# EasyEDA Pro project 荧光充能.eprj

# Schematic Schematic1
Board Name: Board1; Create Date: 2025-11-20; Page Name: P1; Project Name: 荧光充能; Schematic Name: Schematic1; Update Date: 2025-11-20; Company: 嘉立创EDA; Page Size: A4; Version: V1.0
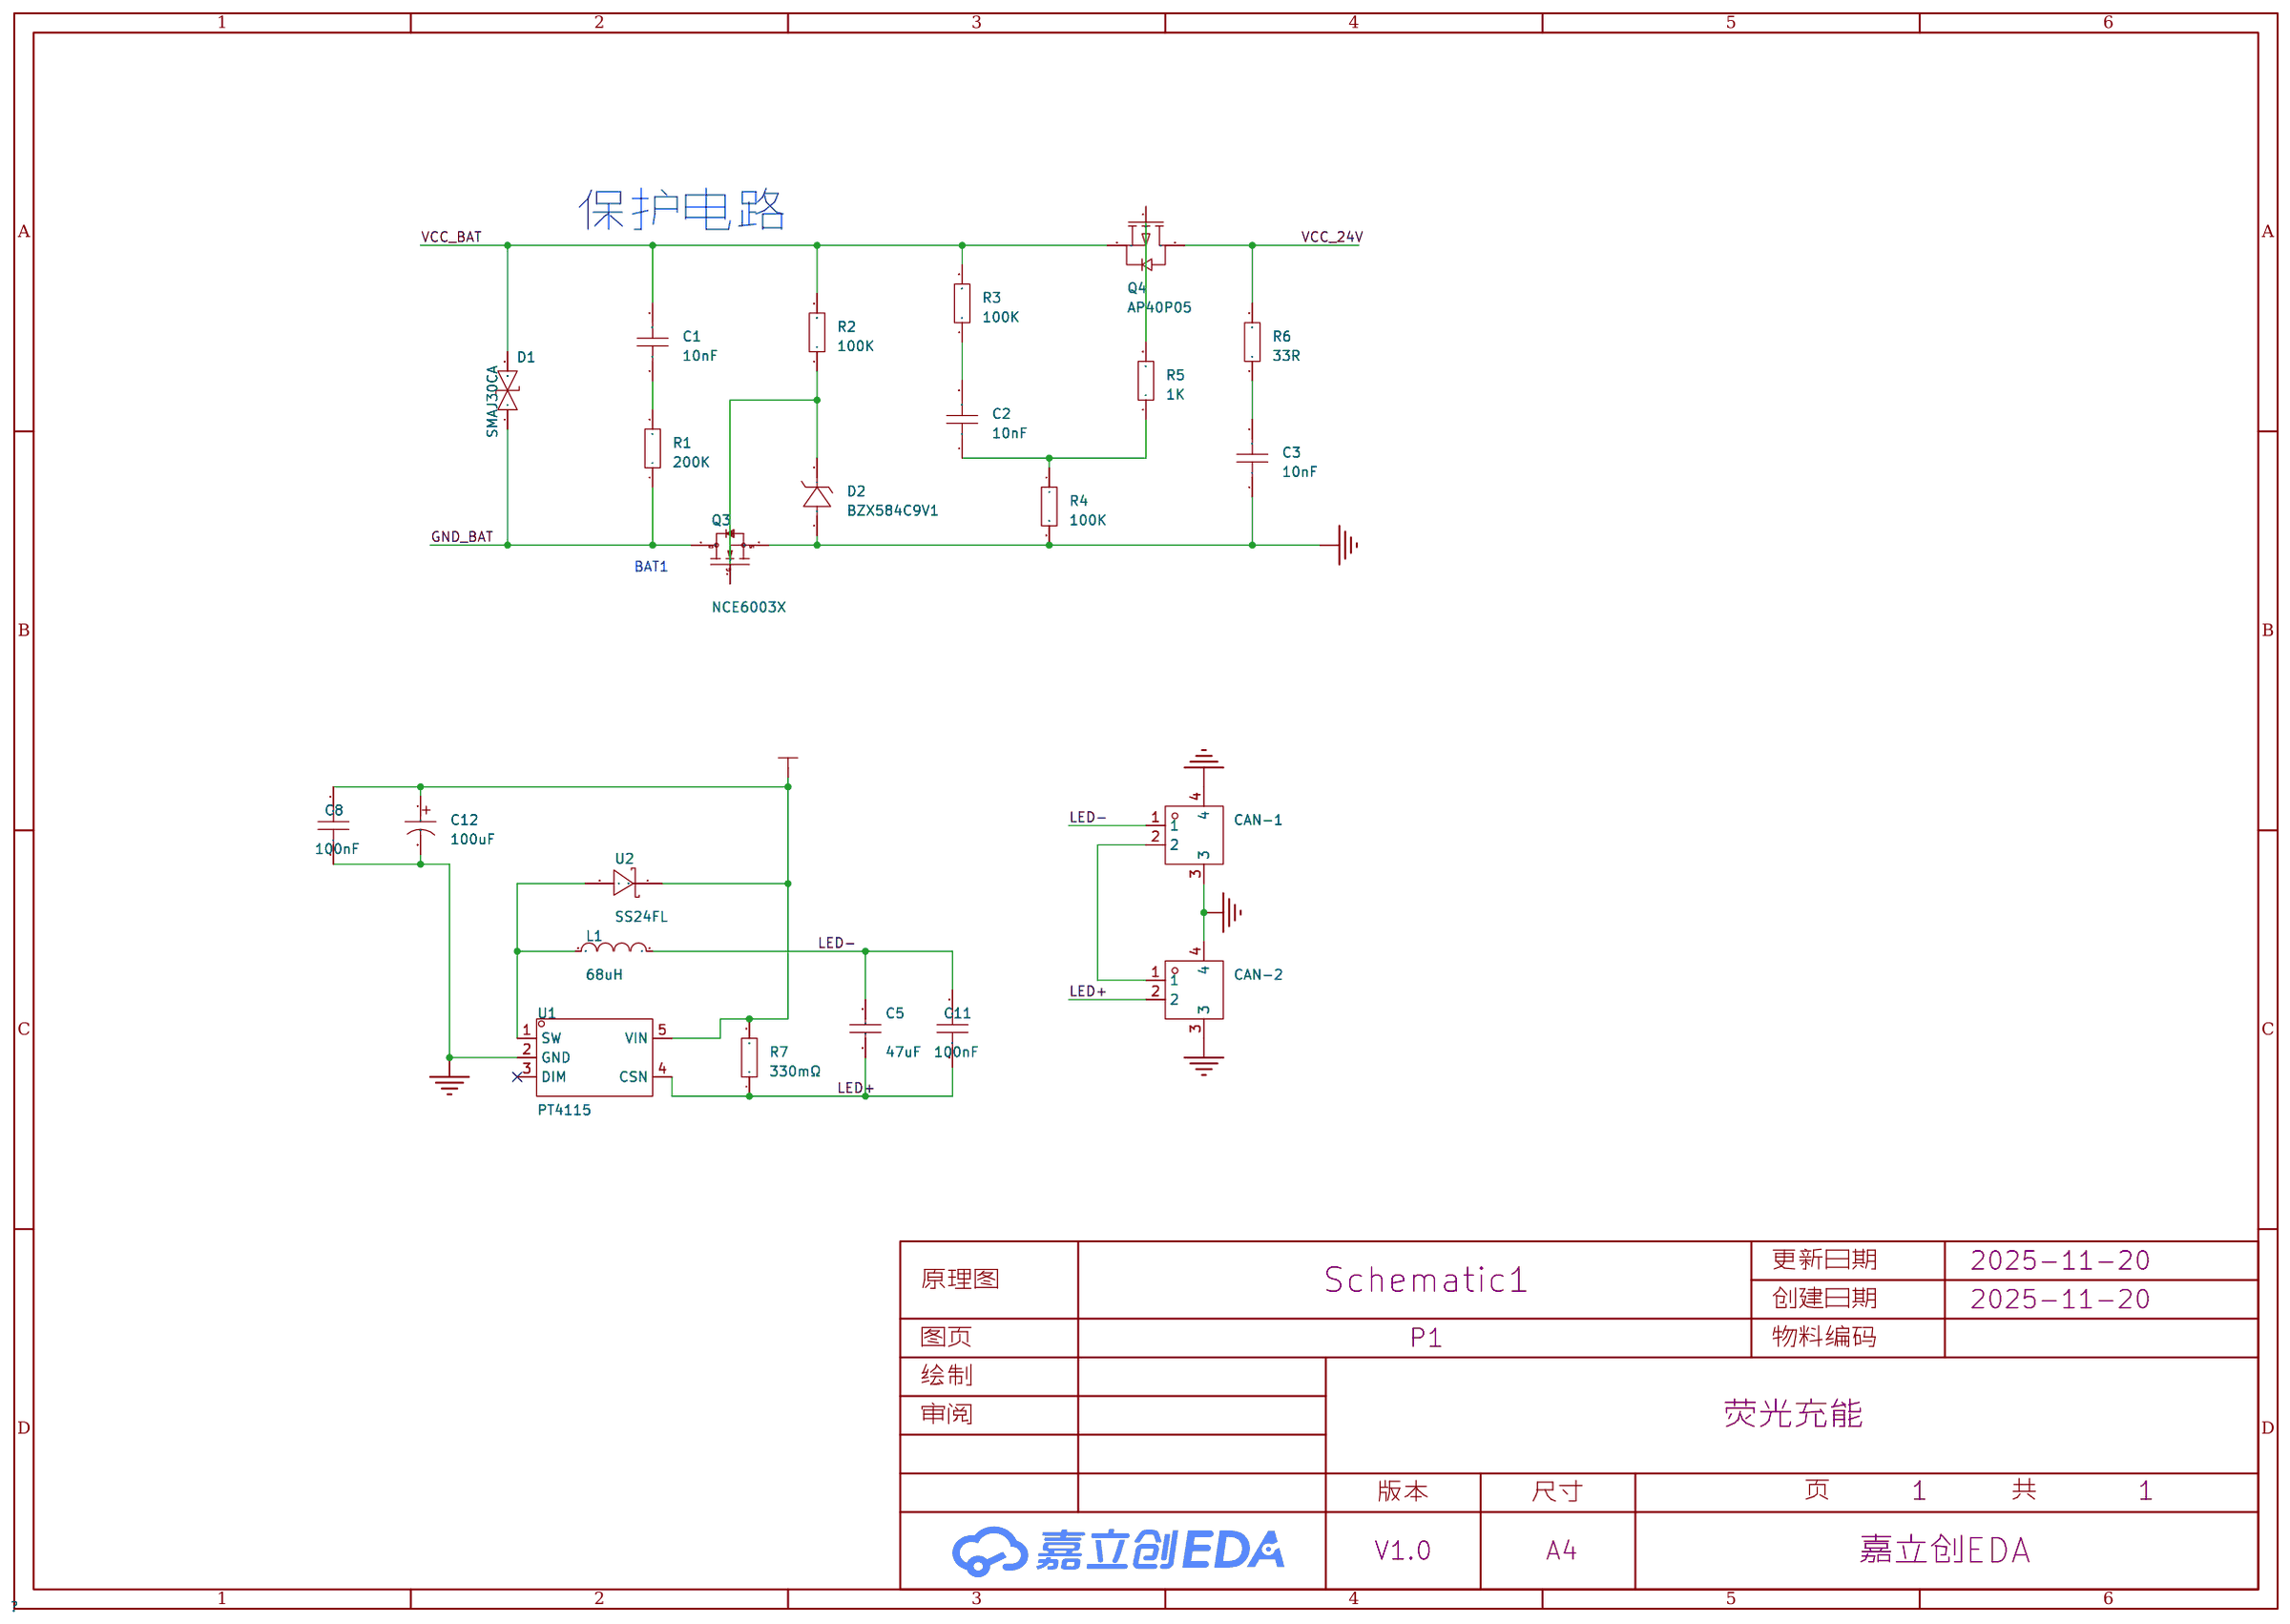
[diagram p0: schematic sheet]

## Parts
C1  10nF  [C0603]
C2  10nF  [C0603]
C3  10nF  [C0603]
C5  47uF  [C0805]
C8  100nF  [C0603]
C11  100nF  [C0603]
C12  100uF  [CAP-SMD_BD6.3-L6.6-W6.6-LS7.2-FD]
CAN-1  X1251WVS-02HF-LPSW  [郭哥CAN2脚母接口]
CAN-2  X1251WVS-02HF-LPSW  [郭哥CAN2脚母接口]
D1  SMAJ30CA  [SMA_L4.4-W2.6-LS5.0-BI]
D2  BZX584C9V1  [SOD-523_L1.2-W0.8-LS1.6-FD]
L1  68uH  [IND-SMD_L6.0-W6.0]
Q3  NCE6003X  [SOT-23-3_L2.9-W1.3-P1.90-LS2.4-BR]
Q4  AP40P05  [SOT-23-3_L2.9-W1.3-P1.90-LS2.4-BR]
R1  200K  [R0603]
R2  100K  [R0603]
R3  100K  [R0603]
R4  100K  [R0603]
R5  1K  [R0603]
R6  33R  [R0603]
R7  330mΩ  [R1206]
U1  PT4115  [SOT-89-5_L4.5-W2.5-P1.50-LS4.5-BR]
U2  SS24FL  [SOD-123FL_L2.8-W1.8-LS3.6-RD]

## Library data of the parts
C1-C3 = CAP_0603: Supplier Footprint: 0603
C5 = CL21B105KBFNNNE: 容值:1uF;精度:±10%;额定电压:50V;材质(温度系数):X7R;; LCSC Part Name: 1uF ±10% 50V; Supplier Part: C28323; Manufacturer: SAMSUNG(三星); Supplier Footprint: 0805; JLCPCB Part Class: 基础库; Datasheet: https://atta.szlcsc.com/upload/public/pdf/source/20160218/1457707763339.pdf; Supplier: LCSC; Tolerance: ±10%; Voltage Rated: 50V; Temperature Coefficient: X7R
C8 C11 = CGA0603X7R104K500JT: 容值:100nF;精度:±10%;额定电压:50V;温度系数:X7R;; LCSC Part Name: 100nF ±10% 50V; Supplier Part: C6119867; Manufacturer: HRE(芯声); Supplier Footprint: 0603; JLCPCB Part Class: 扩展库; Datasheet: https://atta.szlcsc.com/upload/public/pdf/source/20250103/C44077DA9E7B3EFAE02F22B6D3D1CBC9.pdf; Supplier: LCSC; Tolerance: ±10%; Voltage Rating: 50V; Temperature Coefficient: X7R
C12 = HV101M035E077ETR: LCSC Part Name: 100uF ±20% 35V; Supplier Part: C59934; Manufacturer: CapXon(丰宾); Supplier Footprint: SMD,D6.3xL7.7mm; JLCPCB Part Class: 扩展库; Datasheet: https://item.szlcsc.com/datasheet/HV101M035E077ETR/60986.html; Supplier: LCSC; Tolerance: ±20%; Voltage Rating: 35V; Diameter: 6.3mm; Height - Seated (Max): 7.7mm; Lifetime: 2000hrs@105℃; Operating Temperature: -55℃~+105℃
CAN-1 CAN-2 = X1251WVS-02HF-LPSW: Supplier: LCSC; Supplier Part: C388714; Manufacturer: XKB Enterprise
D1 = SMAJ30CA_C110043: 反向截止电压(Vrwm):30V;最大钳位电压:48.4V;峰值脉冲电流(Ipp)@10/1000us:8.3A;峰值脉冲功率(Ppp)@10/1000us:400W;击穿电压:33.3V;; LCSC Part Name: 双向TVS 30V截止 8.3A峰值脉冲; Supplier Part: C110043; Manufacturer: MDD; Supplier Footprint: SMA(DO-214AC); JLCPCB Part Class: 扩展库; Datasheet: https://atta.szlcsc.com/upload/public/pdf/source/20230314/4319D8044EE29783A53F6AC60595AA71.pdf; Supplier: LCSC; Reverse Stand-Off Voltage (Vrwm): 30V; Maximum Clamping Voltage: 48.4V; Peak Pulse Current (Ipp)@10/1000us: 8.3A; Peak Pulse Power Dissipation (Ppp)@10/1000us: 400W; Breakdown Voltage: 33.3V; Reverse Leakage Current (Ir): 1uA; Type: TVS
D2 = BZX584C9V1_C19077465: 二极管配置:独立式;稳压值(标称值):9.1V;稳压值(范围):8.5V~9.6V;功率:150mW;; Supplier Part: C19077465; Manufacturer: 宏迦橙; Supplier Footprint: SOD-523; Datasheet: https://atta.szlcsc.com/upload/public/pdf/source/20231117/AFAEAC6106ACB8F1D9C0D87BFA0778C8.pdf; Supplier: LCSC; Diode Configuration: 独立式; Zener Voltage (Nom): 9.1V; Reverse Leakage Current (Ir): 500nA@6V; Zener Voltage (Range): 8.5V~9.6V; Power Dissipation: 150mW; Zener Impedance (Zzt): 15Ω
L1 = YNR6045-680M: 电感值:68uH;精度:±20%;额定电流:1A;; LCSC Part Name: 68uH ±20%; Supplier Part: C341069; Manufacturer: YJYCOIN(益嘉源); Supplier Footprint: SMD,6x6mm; JLCPCB Part Class: 扩展库; Datasheet: https://atta.szlcsc.com/upload/public/pdf/source/20200623/C341061_0A0CD6873979BE5F18E11D024AF5EA9E.pdf; Supplier: LCSC; Tolerance: ±20%; Rated Current: 1A; DC Resistance (DCR): 289mΩ
Q3 = NCE6003X: 类型:1个N沟道;漏源电压(Vdss):60V;功率(Pd):1.7W;阈值电压(Vgs(th)@Id):-;; LCSC Part Name: 1个N沟道 耐压:60V; Supplier Part: C2934580; Manufacturer: NCE(无锡新洁能); Supplier Footprint: SOT-23; JLCPCB Part Class: 扩展库; Datasheet: https://atta.szlcsc.com/upload/public/pdf/source/20211220/7FAD3A98A94E9F528C3100ED5588E3D1.pdf; Supplier: LCSC; Type: 1个N沟道; Drain Source Voltage (Vdss): 60V; Power Dissipation (Pd): 1.7W; Operating Temperature: -55℃~+150℃
Q4 = AP40P05: 类型:-;漏源电压(Vdss):40V;连续漏极电流(Id):5A;导通电阻(RDS(on)):85mΩ@10V;耗散功率(Pd):2W;阈值电压(Vgs(th)):1.6V;; LCSC Part Name: P沟道,电流:5A,耐压:40V; Supplier Part: C2886385; Manufacturer: ALLPOWER(铨力); Supplier Footprint: SOT-23; JLCPCB Part Class: 扩展库; Datasheet: https://atta.szlcsc.com/upload/public/pdf/source/20210816/F931A2A0BF8B1F02740150C8A4490BD8.pdf; Supplier: LCSC; Drain to Source Voltage: 40V; Current - Continuous Drain(Id): 5A; RDS(on): 85mΩ@10V; Pd - Power Dissipation: 2W; Gate Threshold Voltage (Vgs(th)@Id): 1.6V; Gate Charge(Qg): 60nC@10V; Input Capacitance(Ciss@Vds): 596pF@20V; Reverse Transfer Capacitance (Crss@Vds): 70pF@20V; Operating Temperature: -55℃~+150℃
R1-R6 = Res_0603: Supplier Footprint: 0603
R7 = 1206W4F330LT5E: 电阻类型:厚膜电阻;阻值:330mΩ;精度:±1%;功率:250mW;最大工作电压:200V;温度系数:±800ppm/℃;; LCSC Part Name: 330mΩ ±1% 250mW 厚膜电阻; Supplier Part: C25337; Manufacturer: UNI-ROYAL(厚声); Supplier Footprint: 1206; JLCPCB Part Class: 扩展库; Datasheet: https://atta.szlcsc.com/upload/public/pdf/source/20200306/C422600_1E6D84923E4A46A82E41ADD87F860B5C.pdf; Supplier: LCSC; Type: 厚膜电阻; Tolerance: ±1%; Power(Watts): 250mW; Overload Voltage (Max): 200V; Temperature Coefficient: ±800ppm/℃; Operating Temperature Range: -55℃~+155℃
U1 = PT4115_C347356: 类型:-;输入电压:-;开关频率:-;通道数:-;输出电压:-;输出电流:-;调光:-;; Supplier Part: C347356; Manufacturer: UMW(友台半导体); Supplier Footprint: SOT-89-5; JLCPCB Part Class: 扩展库; Datasheet: https://atta.szlcsc.com/upload/public/pdf/source/20241025/03C13C0029ED384DE85B3A39B3F7BBBE.pdf; Supplier: LCSC
U2 = SS24FL_C894433: 正向压降(Vf):550mV@2A;直流反向耐压(Vr):40V;整流电流:2A;; LCSC Part Name: 电压:40V 电流:2A; Supplier Part: C894433; Manufacturer: onsemi(安森美); Supplier Footprint: SOD-123F; JLCPCB Part Class: 扩展库; Datasheet: https://atta.szlcsc.com/upload/public/pdf/source/20221020/6D38FC9F36009849966ACC38751C5C4B.pdf; Supplier: LCSC; Forward Voltage (Vf@If): 550mV@2A; Reverse Voltage (Vr): 40V; Rectified Current: 2A; Reverse Leakage Current (Ir): 100uA@40V

## Nets
GND: C3.1 C8.1 C12.2 CAN-1.3 CAN-1.4 CAN-2.3 CAN-2.4 D2.1(A) Q3.2(S) R4.2 U1.2(GND)
GND_BAT: D1.1 Q3.3(D) R1.1
VCC_24V: C8.2 C12.1 Q4.3(D) R6.2 R7.2 U1.5(VIN) U2.1(C)
VCC_BAT: C1.2 D1.2 Q4.2(S) R2.2 R3.2
LED+: C5.1 C11.1 CAN-2.2 R7.1 U1.4(CSN)
LED-: C5.2 C11.2 CAN-1.1 L1.2
$1N477: C1.1 R1.2
$1N478: Q4.1(G) R5.2
$1N484: D2.2(K) Q3.1(G) R2.1
$1N485: C2.2 R3.1
$1N486: C2.1 R4.1 R5.1
$1N487: C3.2 R6.1
$1N1492: L1.1 U1.1(SW) U2.2(A)
$1N1834: CAN-1.2 CAN-2.1

Not connected (* = marked no-connect by the designer): U1 3(DIM)*

## Notes on the sheet
- 保护电路
- BAT1

# Board PCB1
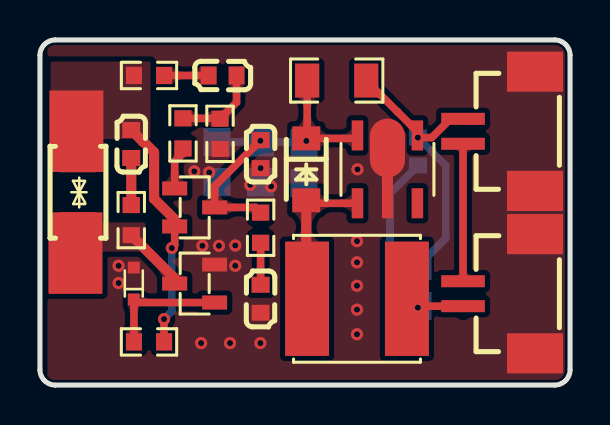
[diagram p1: board, top side]
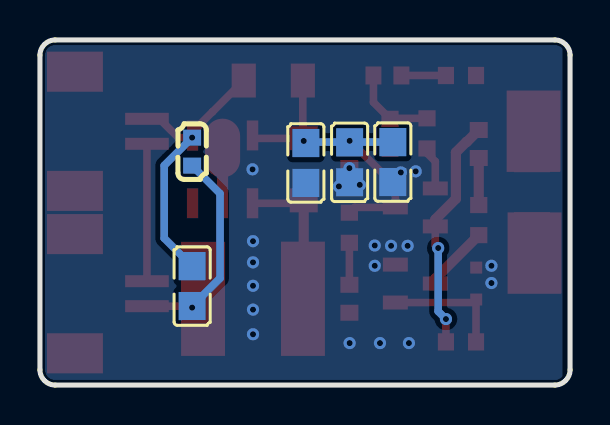
[diagram p2: board, bottom side, seen from below]

Outline 26.54 x 17.27 mm; copper layers: Top Layer, Bottom Layer. Coordinates in mm from the lower left corner of the outline.
Outline path: 0,16.51 0,0.76 arc(0.22,0.22) 0.76,0 25.78,0 arc(26.32,0.22) 26.54,0.76 26.54,16.51 arc(26.32,17.05) 25.78,17.27 0.76,17.27 arc(0.22,17.05) 0,16.51
Stack: Top Layer 0.035mm / Dielectric1 1.51mm FR4 er 4.5 / Bottom Layer 0.035mm

## Design rules (mm)
template: 自定义配置
spacing copperThickness1oz (default): track to track 0.102, other pairs 0.152 to 0.3
spacing copperThickness2oz: track to track 0.203, other pairs 0.152 to 0.3
track width copperThickness1oz (default): min 0.127, default 0.254, max 2.54
track width copperThickness2oz: min 0.203, default 0.254, max 2.54
differential pair differentialPair (default): width min 0.127, default 0.254, max 2.54; gap min 0.152, default 0.152
via viaSize (default): diameter min 0.5, default 0.61, max 10; hole min 0.3, default 0.305, max 6.3

## Placement (name value [footprint] x y rotation side)
C1  10nF  [C0603]  4.57 12.06 90 top
C2  10nF  [C0603]  9.14 15.49 180 top
C3  10nF  [C0603]  11.05 4.32 90 top
C4  47uF  [C0805]  13.23 11.12 90 bottom
C5  47uF  [C0805]  18.92 4.95 270 bottom
C6  47uF  [C0805]  11.04 11.15 90 bottom
C7  47uF  [C0805]  8.87 11.16 90 bottom
C8  100nF  [C0603]  11.05 11.56 90 top
C11  100nF  [C0603]  18.92 11.68 270 bottom
CAN-1  X1251WVS-02HF-LPSW  [郭哥CAN2脚母接口]  23.11 4.57 90 top
CAN-2  X1251WVS-02HF-LPSW  [郭哥CAN2脚母接口]  23.11 12.7 90 top
D1  SMAJ30CA  [SMA_L4.4-W2.6-LS5.0-BI]  1.91 9.65 90 top
D2  BZX584C9V1  [SOD-523_L1.2-W0.8-LS1.6-FD]  4.7 5.08 270 top
L1  68uH  [IND-SMD_L6.0-W6.0]  15.88 4.32 0 top
NOREF  -  [Pad_e30]  1.78 6.6 0 top
NOREF#2  -  [Pad_e29]  1.83 12.7 0 top
Q3  NCE6003X  [SOT-23-3_L2.9-W1.3-P1.90-LS2.4-BR]  7.75 5.08 0 top
Q4  AP40P05  [SOT-23-3_L2.9-W1.3-P1.90-LS2.4-BR]  7.75 8.89 180 top
R1  200K  [R0603]  4.57 8.26 90 top
R2  100K  [R0603]  5.46 2.16 0 top
R3  100K  [R0603]  5.46 15.49 180 top
R4  100K  [R0603]  9.02 12.57 270 top
R5  1K  [R0603]  7.16 12.6 270 top
R6  33R  [R0603]  11.05 7.87 90 top
R7  330mΩ  [R1206]  14.86 15.24 180 top
U1  PT4115  [SOT-89-5_L4.5-W2.5-P1.50-LS4.5-BR]  17.4 10.8 270 top
U2  SS24FL  [SOD-123FL_L2.8-W1.8-LS3.6-RD]  13.34 10.8 270 top

## Footprints (pads in the part's own frame, mm; a bottom-side part is the same pattern mirrored in y, then rotated)
C0603
  rect 0.8x0.9 smd: 1(-0.7,0) 2(0.7,0)
C0805
  rect 1.41x1.35 smd: 1(-1,0) 2(1,0)
IND-SMD_L6.0-W6.0
  rect 2.2x5.72 smd: 1(-2.5,0) 2(2.5,0)
Pad_e29
  custom 2.697x4.073 smd: 1(0,0)
Pad_e30
  custom 2.697x4.073 smd: 1(0,0)
R0603
  rect 0.806x0.864 smd: 1(-0.753,0) 2(0.753,0)
R1206
  rect 1.208x1.701 smd: 1(-1.479,0) 2(1.479,0)
SMA_L4.4-W2.6-LS5.0-BI
  rect 2x1.8 smd: 1(-2,0) 2(2,0)
SOD-123FL_L2.8-W1.8-LS3.6-RD
  rect 1.2x1.4 smd: 1(-1.55,0) 2(1.55,0)
SOD-523_L1.2-W0.8-LS1.6-FD
  rect 0.6x0.6 smd: 1(-0.8,0) 2(0.8,0)
SOT-23-3_L2.9-W1.3-P1.90-LS2.4-BR
  rect 1.25x0.7 smd: 1(1,-0.95) 2(1,0.95) 3(-1,0)
SOT-89-5_L4.5-W2.5-P1.50-LS4.5-BR
  rect 1.5x0.574 smd: 1(1.698,-1.5) 3(1.698,1.5) 4(-1.698,1.5) 5(-1.698,-1.5)
  oval 2.94x1.76 smd: 2(-1.067,0)
  rect 2.209x0.552 smd: 2(1.343,0)
郭哥CAN2脚母接口
  rect 0.6x2.184 smd: 1(-0.625,1.929) 2(0.625,1.929)
  rect 2.006x2.8 smd: 3(2.983,-1.675) 4(-2.983,-1.675)

## Nets
GND: C3.1 C4.1 C6.1 C7.1 C8.1 CAN-1.3 CAN-1.4 CAN-2.3 CAN-2.4 D2.1 Q3.2 R4.2 U1.2
GND_BAT: D1.1 NOREF.1 Q3.3 R1.1
VCC_24V: C4.2 C6.2 C7.2 C8.2 Q4.3 R6.2 R7.2 U1.5 U2.1
VCC_BAT: C1.2 D1.2 NOREF#2.1 Q4.2 R2.2 R3.2
LED+: C5.1 C11.1 CAN-2.2 R7.1 U1.4
LED-: C5.2 C11.2 CAN-1.1 L1.2
$1N477: C1.1 R1.2
$1N478: Q4.1 R5.2
$1N484: D2.2 Q3.1 R2.1
$1N485: C2.2 R3.1
$1N486: C2.1 R4.1 R5.1
$1N487: C3.2 R6.1
$1N1492: L1.1 U1.1 U2.2
$1N1834: CAN-1.2 CAN-2.1

Pads without a net: U1 3

## Via types
v1: diameter 0.61, hole 0.305, Top Layer to Bottom Layer, 26 vias

## Routing (per net, layer and track width the routed paths; a pad name or vN(x,y) marks a point on that pad's centre or on a via; arc(x,y) is an arc through that point)
GND:
  vias: v1(3.94,5.97) v1(3.94,5.11) v1(7.73,10.7) v1(8.07,2.1) v1(8.13,6.97) v1(8.47,10.64) v1(8.96,6.97) v1(9.52,2.1) v1(9.78,6.98) v1(9.78,5.97) v1(10.53,10.02) v1(11.05,10.86) v1(11.04,2.1) v1(11.58,9.94) v1(15.88,7.2) v1(15.88,6.14) v1(15.88,4.97) v1(15.88,3.77) v1(15.88,2.54) v1(15.9,10.8)
GND_BAT: length 3.3
  Top Layer w0.508: Q3.3 6.75,5.33 R1.1
VCC_24V: length 16.8
  Top Layer w0.381: 13.59,12.34 13.38,12.56 R7.2 ; 13.59,12.34 U2.1 ; 13.59,12.34 15.75,12.34 U1.5 ; R6.2 10.79,8.89 Q4.3 8.75,9.95 C8.2
  Bottom Layer w0.381: C7.2 13.28,12.16 v1(13.34,12.22)
  vias: v1(11.04,12.22)
VCC_BAT: length 11.7
  Top Layer w0.381: v1(6.21,3.3) R2.2 ; v1(6.6,6.86) 6.75,7 Q4.2
  Top Layer w0.508: C1.2 5.17,12.17 5.19,12.17 5.72,11.65 5.72,9.32 6.75,8.29 Q4.2
  Bottom Layer w0.381: v1(6.6,6.86) 6.6,3.69 v1(6.21,3.3)
LED+: length 14.1
  Top Layer w0.381: v1(18.92,12.38) 19.62,12.38 20.56,13.33 CAN-2.2 ; R7.1 17.9,13.67 17.91,13.67 18.62,12.96 18.62,12.96 18.9,12.68 U1.4
  Bottom Layer w0.381: C5.1 20.32,7.35 20.32,10.99 v1(18.92,12.38)
LED-: length 10.5
  Top Layer w0.381: v1(18.92,3.88) 18.99,3.95 CAN-1.1
  Bottom Layer w0.381: 18.92,10.98 17.53,9.59 17.53,5.35 C5.2
$1N477: length 2.4
  Top Layer w0.508: C1.1 R1.2
$1N478: length 2.2
  Top Layer w0.381: Q4.1 6.75,11.19 7.16,11.61 R5.2
$1N484: length 6.2
  Top Layer w0.381: Q3.1 4.85,4.13 4.71,4.27 ; R2.1 4.71,4.27 ; 4.71,4.27 D2.2
$1N485: length 2.2
  Top Layer w0.381: R3.1 C2.2
$1N486: length 4.4
  Top Layer w0.381: C2.1 9.84,14.15 R4.1 8.99,13.35 R5.1
$1N487: length 2.1
  Top Layer w0.381: R6.1 C3.2
$1N1492: length 7.6
  Top Layer w0.381: U1.1 13.48,9.1 U2.2
  Top Layer w0.508: U2.2 13.34,4.36 L1.1
$1N1834: length 6.9
  Top Layer w0.381: CAN-1.2 CAN-2.1

## Copper pours and planes (outline as drawn; the poured copper is in the pictures)
GND on Top Layer: 0.38,17.27 26.29,17.27 26.29,-0.13 0.38,-0.13
GND on Bottom Layer: 0.38,17.27 26.42,17.27 26.42,-0.13 0.38,-0.13
GND_BAT on Top Layer: 0.5,8.14 5.27,8.14 5.27,6.68 0.5,6.68
VCC_BAT on Top Layer: 0.51,12.32 5.54,12.32 5.54,16.2 0.53,16.2 0.53,12.35

Small or netless copper shapes (teardrops, artwork), in the pictures only: 29 on Top Layer
